# EAGLE board registers_half_layout_withwires (EAGLE 9.5.2), part 1 of 2
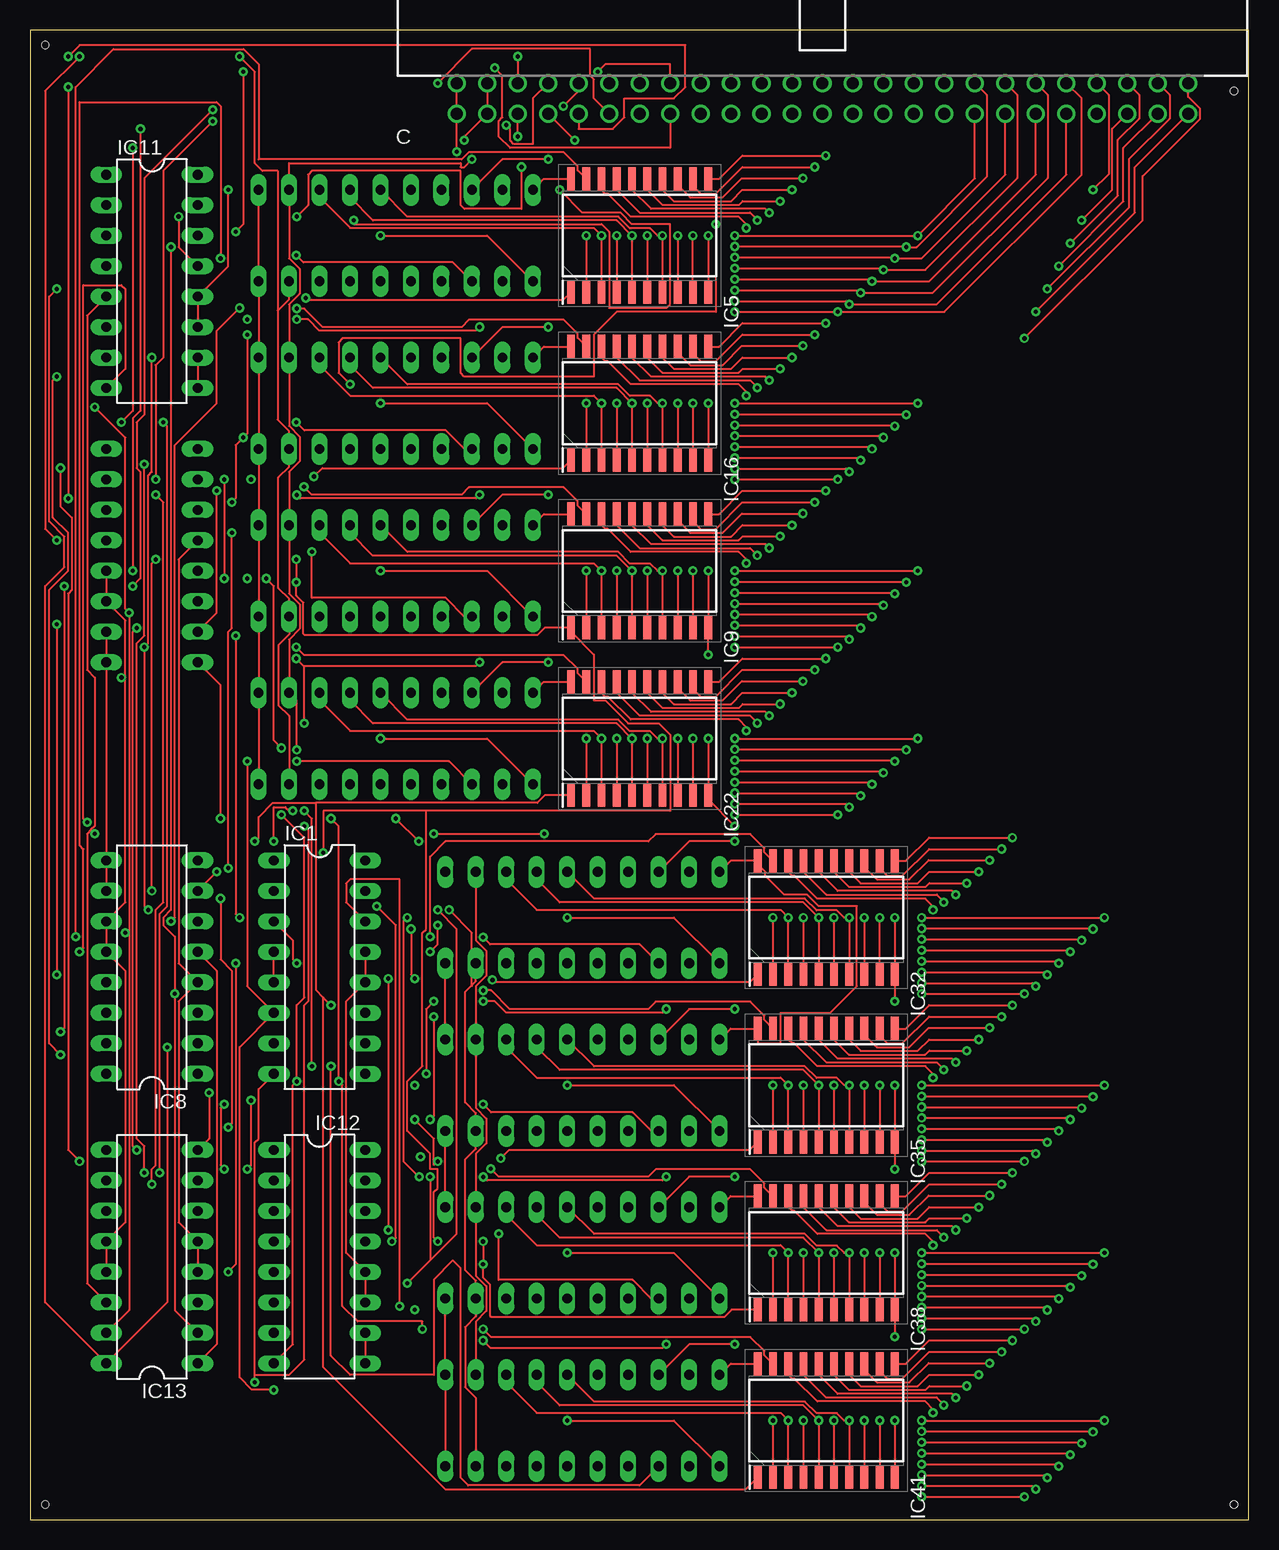
[diagram p2: board, top side]
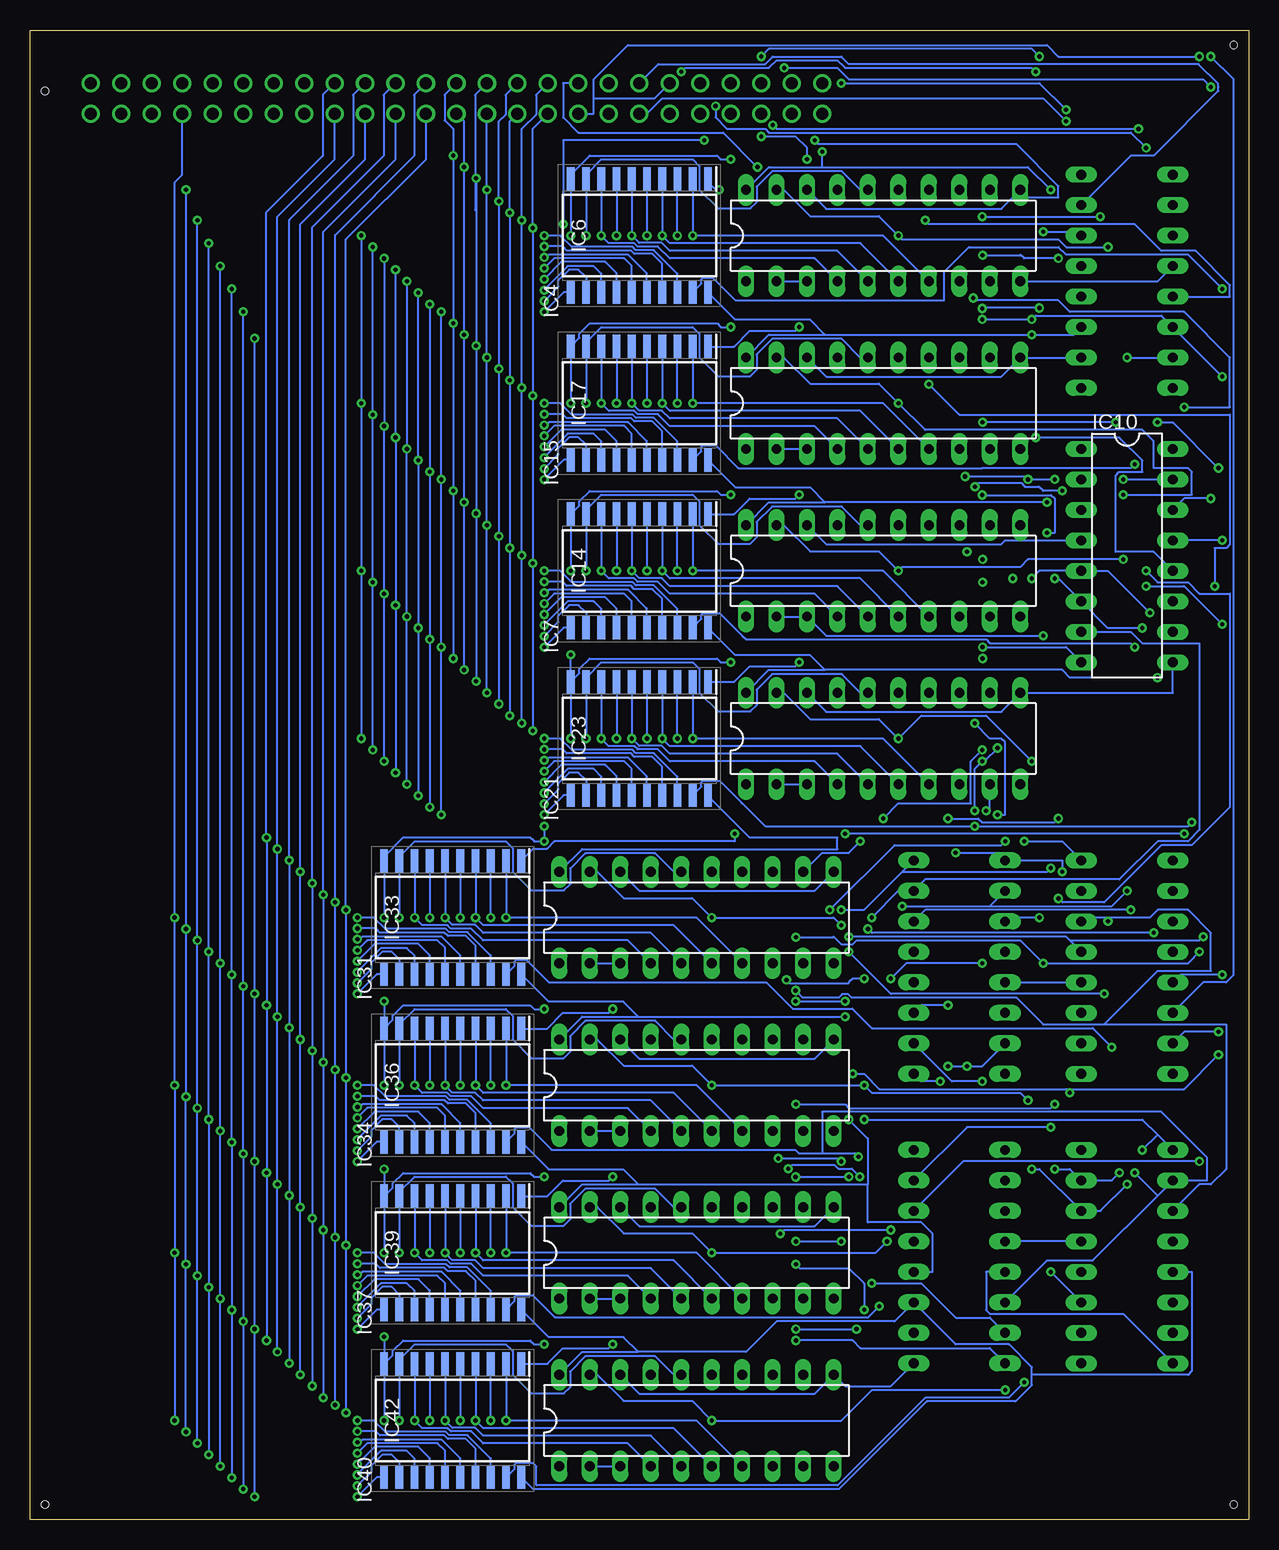
[diagram p3: board, bottom side, seen from below]

Size 101.58 x 124.13 mm. Coordinates in mm from the lower left corner, seen from the top.
Outline: 0,0 101.58,0 101.58,124.13 0,124.13 0,0
Copper layers (1*16): Top 0.035mm / dielectric 1.5mm / Bottom 0.035mm
Design rules "default *": minimum track width 6mil, minimum drill 0.35mm, track to track 6mil, track to pad 6mil, pad to pad 6mil, via to via 6mil, smd to smd 6mil, copper to edge 40mil, drill to drill 6mil, minimum pad ring 10mil, minimum via ring 8mil, stop-mask expansion 4mil, vias tented up to drill 0mil, thermal gap 10mil
Holes 0.6 mm at 100.33,1.27 1.27,1.27 1.27,122.87 100.33,119.06

## Footprints (pad centres in the part's own frame; a part is rotated, then mirrored left to right if it is on the bottom)
PAK100/2500-5-50 = drill 1 pad 1.422: 1 -30.48,-1.27; 2 -30.48,1.27; 3 -27.94,-1.27; 4 -27.94,1.27; 5 -25.4,-1.27; 6 -25.4,1.27; 7 -22.86,-1.27; 8 -22.86,1.27; 9 -20.32,-1.27; 10 -20.32,1.27; 11 -17.78,-1.27; 12 -17.78,1.27; 13 -15.24,-1.27; 14 -15.24,1.27; 15 -12.7,-1.27; 16 -12.7,1.27; 17 -10.16,-1.27; 18 -10.16,1.27; 19 -7.62,-1.27; 20 -7.62,1.27; 21 -5.08,-1.27; 22 -5.08,1.27; 23 -2.54,-1.27; 24 -2.54,1.27; 25 0,-1.27; 26 0,1.27; 27 2.54,-1.27; 28 2.54,1.27; 29 5.08,-1.27; 30 5.08,1.27; 31 7.62,-1.27; 32 7.62,1.27; 33 10.16,-1.27; 34 10.16,1.27; 35 12.7,-1.27; 36 12.7,1.27; 37 15.24,-1.27; 38 15.24,1.27; 39 17.78,-1.27; 40 17.78,1.27; 41 20.32,-1.27; 42 20.32,1.27; 43 22.86,-1.27; 44 22.86,1.27; 45 25.4,-1.27; 46 25.4,1.27; 47 27.94,-1.27; 48 27.94,1.27; 49 30.48,-1.27; 50 30.48,1.27
DIL16 = drill 0.813 long: 1 -8.89,-3.81; 2 -6.35,-3.81; 3 -3.81,-3.81; 4 -1.27,-3.81; 5 1.27,-3.81; 6 3.81,-3.81; 7 6.35,-3.81; 8 8.89,-3.81; 9 8.89,3.81; 10 6.35,3.81; 11 3.81,3.81; 12 1.27,3.81; 13 -1.27,3.81; 14 -3.81,3.81; 15 -6.35,3.81; 16 -8.89,3.81
DIL20 = drill 0.813 long: 1 -11.43,-3.81; 2 -8.89,-3.81; 3 -6.35,-3.81; 4 -3.81,-3.81; 5 -1.27,-3.81; 6 1.27,-3.81; 7 3.81,-3.81; 8 6.35,-3.81; 9 8.89,-3.81; 10 11.43,-3.81; 11 11.43,3.81; 12 8.89,3.81; 13 6.35,3.81; 14 3.81,3.81; 15 1.27,3.81; 16 -1.27,3.81; 17 -3.81,3.81; 18 -6.35,3.81; 19 -8.89,3.81; 20 -11.43,3.81
SOIC127P1030X265-20N = smd 1.95 x 0.65: 1 -4.725,5.715; 2 -4.725,4.445; 3 -4.725,3.175; 4 -4.725,1.905; 5 -4.725,0.635; 6 -4.725,-0.635; 7 -4.725,-1.905; 8 -4.725,-3.175; 9 -4.725,-4.445; 10 -4.725,-5.715; 11 4.725,-5.715; 12 4.725,-4.445; 13 4.725,-3.175; 14 4.725,-1.905; 15 4.725,-0.635; 16 4.725,0.635; 17 4.725,1.905; 18 4.725,3.175; 19 4.725,4.445; 20 4.725,5.715

## Placement (x,y rotation side)
C  2550-5  [PAK100/2500-5-50]  66.04,118.43 0 top
IC1  74AC11032  [DIL16]  24.13,46.04 270 top
IC4  74HCT299N  [DIL20]  30.48,107 0 bottom
IC5  SN74CBT3345DW  [SOIC127P1030X265-20N]  50.8,107 90 top
IC6  SN74CBT3345DW  [SOIC127P1030X265-20N]  50.8,107 270 bottom
IC7  74HCT299N  [DIL20]  30.48,79.06 0 bottom
IC8  74AC11138  [DIL16]  10.16,46.04 90 top
IC9  SN74CBT3345DW  [SOIC127P1030X265-20N]  50.8,79.06 90 top
IC10  74AC11238  [DIL16]  10.16,80.33 270 bottom
IC11  74AC11238  [DIL16]  10.16,103.19 270 top
IC12  74AC11138  [DIL16]  24.13,21.91 270 top
IC13  74AC11032  [DIL16]  10.16,21.91 90 top
IC14  SN74CBT3345DW  [SOIC127P1030X265-20N]  50.8,79.06 270 bottom
IC15  74HCT299N  [DIL20]  30.48,93.03 0 bottom
IC16  SN74CBT3345DW  [SOIC127P1030X265-20N]  50.8,93.03 90 top
IC17  SN74CBT3345DW  [SOIC127P1030X265-20N]  50.8,93.03 270 bottom
IC21  74HCT299N  [DIL20]  30.48,65.09 0 bottom
IC22  SN74CBT3345DW  [SOIC127P1030X265-20N]  50.8,65.09 90 top
IC23  SN74CBT3345DW  [SOIC127P1030X265-20N]  50.8,65.09 270 bottom
IC31  74HCT299N  [DIL20]  46.04,50.16 0 bottom
IC32  SN74CBT3345DW  [SOIC127P1030X265-20N]  66.36,50.16 90 top
IC33  SN74CBT3345DW  [SOIC127P1030X265-20N]  66.36,50.16 270 bottom
IC34  74HCT299N  [DIL20]  46.04,36.2 0 bottom
IC35  SN74CBT3345DW  [SOIC127P1030X265-20N]  66.36,36.2 90 top
IC36  SN74CBT3345DW  [SOIC127P1030X265-20N]  66.36,36.2 270 bottom
IC37  74HCT299N  [DIL20]  46.04,22.23 0 bottom
IC38  SN74CBT3345DW  [SOIC127P1030X265-20N]  66.36,22.23 90 top
IC39  SN74CBT3345DW  [SOIC127P1030X265-20N]  66.36,22.23 270 bottom
IC40  74HCT299N  [DIL20]  46.04,8.26 0 bottom
IC41  SN74CBT3345DW  [SOIC127P1030X265-20N]  66.36,8.26 90 top
IC42  SN74CBT3345DW  [SOIC127P1030X265-20N]  66.36,8.26 270 bottom